# EAGLE design LedMatrix24 (EAGLE 7.7.0)
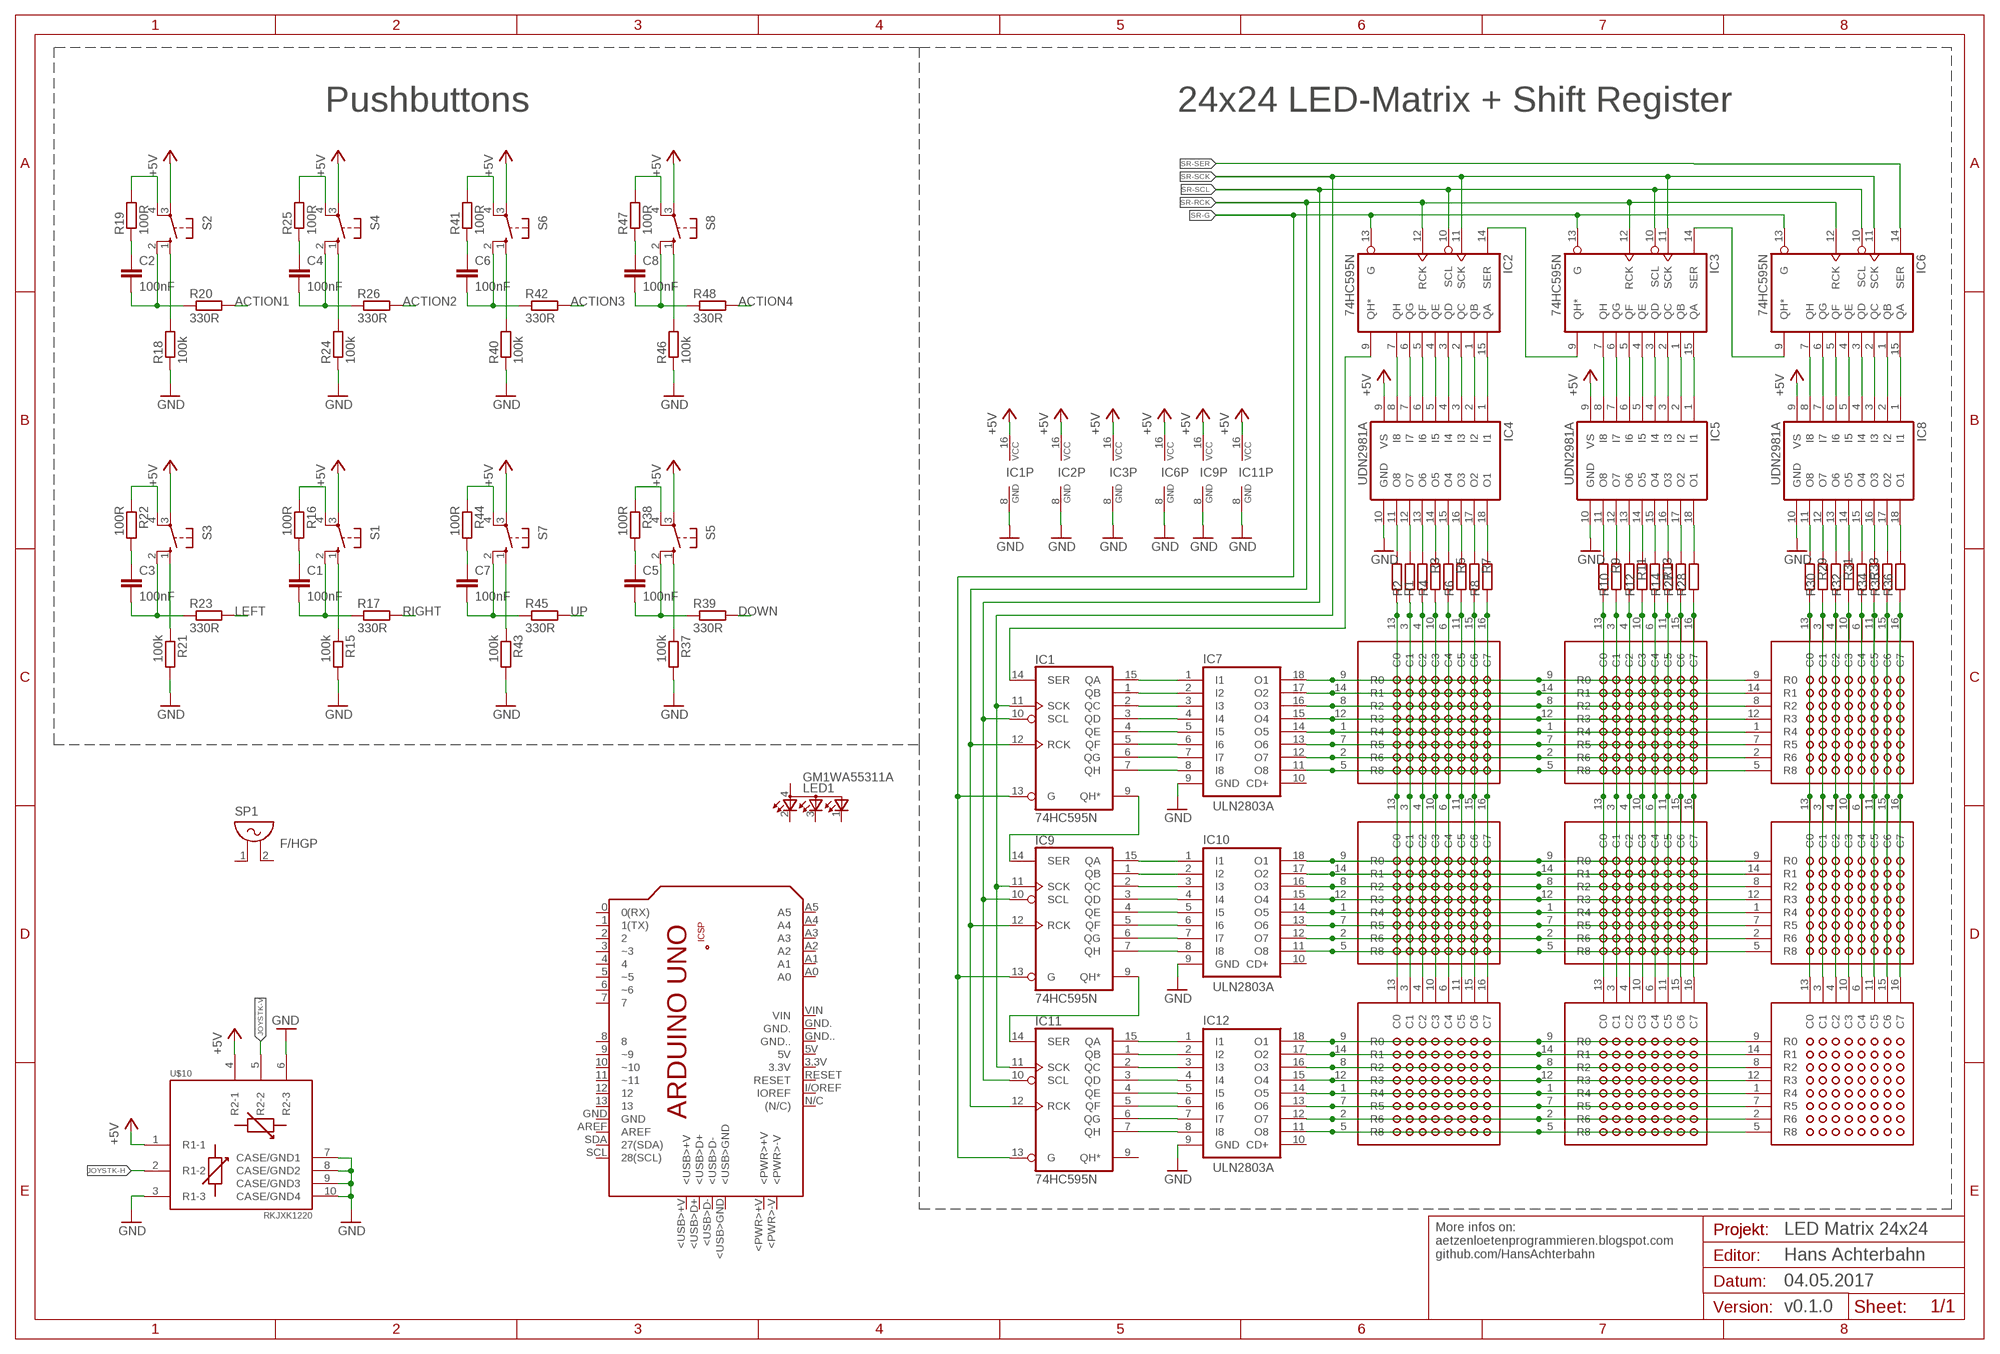
[diagram p0: schematic, sheet 1]

## Parts
C1  100nF  C-EUC0805  [C0805]
C2  100nF  C-EUC0805  [C0805]
C3  100nF  C-EUC0805  [C0805]
C4  100nF  C-EUC0805  [C0805]
C5  100nF  C-EUC0805  [C0805]
C6  100nF  C-EUC0805  [C0805]
C7  100nF  C-EUC0805  [C0805]
C8  100nF  C-EUC0805  [C0805]
IC1  74HC595N  [DIL16]
IC2  74HC595N  [DIL16]
IC3  74HC595N  [DIL16]
IC4  UDN2981A  [DIL18]
IC5  UDN2981A  [DIL18]
IC6  74HC595N  [DIL16]
IC7  ULN2803A  [DIL18]
IC8  UDN2981A  [DIL18]
IC9  74HC595N  [DIL16]
IC10  ULN2803A  [DIL18]
IC11  74HC595N  [DIL16]
IC12  ULN2803A  [DIL18]
LED1  GM1WA55311A  [GM1WA55311A]
PCB1  ARDUINO_UNO  [ARDUINO_UNO]
R1  R-EU_0207/10  [0207/10]
R2  R-EU_0207/10  [0207/10]
R3  R-EU_0207/10  [0207/10]
R4  R-EU_0207/10  [0207/10]
R5  R-EU_0207/10  [0207/10]
R6  R-EU_0207/10  [0207/10]
R7  R-EU_0207/10  [0207/10]
R8  R-EU_0207/10  [0207/10]
R9  R-EU_0207/10  [0207/10]
R10  R-EU_0207/10  [0207/10]
R11  R-EU_0207/10  [0207/10]
R12  R-EU_0207/10  [0207/10]
R13  R-EU_0207/10  [0207/10]
R14  R-EU_0207/10  [0207/10]
R15  100k  R-EU_R0603  [R0603]
R16  100R  R-EU_R0603  [R0603]
R17  330R  R-EU_R0603  [R0603]
R18  100k  R-EU_R0603  [R0603]
R19  100R  R-EU_R0603  [R0603]
R20  330R  R-EU_R0603  [R0603]
R21  100k  R-EU_R0603  [R0603]
R22  100R  R-EU_R0603  [R0603]
R23  330R  R-EU_R0603  [R0603]
R24  100k  R-EU_R0603  [R0603]
R25  100R  R-EU_R0603  [R0603]
R26  330R  R-EU_R0603  [R0603]
R27  R-EU_0207/10  [0207/10]
R28  R-EU_0207/10  [0207/10]
R29  R-EU_0207/10  [0207/10]
R30  R-EU_0207/10  [0207/10]
R31  R-EU_0207/10  [0207/10]
R32  R-EU_0207/10  [0207/10]
R33  R-EU_0207/10  [0207/10]
R34  R-EU_0207/10  [0207/10]
R35  R-EU_0207/10  [0207/10]
R36  R-EU_0207/10  [0207/10]
R37  100k  R-EU_R0603  [R0603]
R38  100R  R-EU_R0603  [R0603]
R39  330R  R-EU_R0603  [R0603]
R40  100k  R-EU_R0603  [R0603]
R41  100R  R-EU_R0603  [R0603]
R42  330R  R-EU_R0603  [R0603]
R43  100k  R-EU_R0603  [R0603]
R44  100R  R-EU_R0603  [R0603]
R45  330R  R-EU_R0603  [R0603]
R46  100k  R-EU_R0603  [R0603]
R47  100R  R-EU_R0603  [R0603]
R48  330R  R-EU_R0603  [R0603]
S1  10-XX  [B3F-10XX]
S2  10-XX  [B3F-10XX]
S3  10-XX  [B3F-10XX]
S4  10-XX  [B3F-10XX]
S5  10-XX  [B3F-10XX]
S6  10-XX  [B3F-10XX]
S7  10-XX  [B3F-10XX]
S8  10-XX  [B3F-10XX]
SP1  F/HGP  [F/HGP]
U$1  TOP-CA-788BS  [TOP-CA-788BS]
U$2  TOP-CA-788BS  [TOP-CA-788BS]
U$3  TOP-CA-788BS  [TOP-CA-788BS]
U$4  TOP-CA-788BS  [TOP-CA-788BS]
U$5  TOP-CA-788BS  [TOP-CA-788BS]
U$6  TOP-CA-788BS  [TOP-CA-788BS]
U$7  TOP-CA-788BS  [TOP-CA-788BS]
U$8  TOP-CA-788BS  [TOP-CA-788BS]
U$9  TOP-CA-788BS  [TOP-CA-788BS]
U$10  RKJXK1220  [RKJXK1220]

## Nets
+5V: IC1.16(VCC) IC2.16(VCC) IC3.16(VCC) IC4.9(VS) IC5.9(VS) IC6.16(VCC) IC8.9(VS) IC9.16(VCC) IC11.16(VCC) S1.3(P) S2.3(P) S3.3(P) S4.3(P) S5.3(P) S6.3(P) S7.3(P) S8.3(P) U$10.1(R1-1) U$10.4(R2-1)
ACTION1: R20.2
ACTION2: R26.2
ACTION3: R42.2
ACTION4: R48.2
DOWN: R39.2
GND: IC1.8(GND) IC2.8(GND) IC3.8(GND) IC4.10(GND) IC5.10(GND) IC6.8(GND) IC7.9(GND) IC8.10(GND) IC9.8(GND) IC10.9(GND) IC11.8(GND) IC12.9(GND) R15.2 R18.1 R21.2 R24.1 R37.2 R40.1 R43.2 R46.1 U$10.3(R1-3) U$10.6(R2-3) U$10.7(CASE/GND1) U$10.8(CASE/GND2) U$10.9(CASE/GND3) U$10.10(CASE/GND4)
JOYSTK-H: U$10.2(R1-2)
JOYSTK-V: U$10.5(R2-2)
LEFT: R23.2
N$1: IC7.16(O3) U$1.8(R2) U$2.8(R2) U$3.8(R2)
N$2: IC7.14(O5) U$1.1(R4) U$2.1(R4) U$3.1(R4)
N$3: IC7.11(O8) U$1.5(R8) U$2.5(R8) U$3.5(R8)
N$4: IC7.15(O4) U$1.12(R3) U$2.12(R3) U$3.12(R3)
N$5: IC5.17(O2) R27.2
N$6: IC5.18(O1) R28.2
N$7: IC3.1(QB) IC5.2(I2)
N$8: IC3.15(QA) IC5.1(I1)
N$9: IC8.11(O8) R29.1
N$10: IC8.12(O7) R30.2
N$11: IC8.13(O6) R31.1
N$12: IC8.14(O5) R32.2
N$13: IC8.15(O4) R33.1
N$14: IC8.16(O3) R34.2
N$15: IC6.2(QC) IC8.3(I3)
N$17: IC6.3(QD) IC8.4(I4)
N$18: IC7.13(O6) U$1.7(R5) U$2.7(R5) U$3.7(R5)
N$19: IC7.12(O7) U$1.2(R6) U$2.2(R6) U$3.2(R6)
N$20: IC6.4(QE) IC8.5(I5)
N$21: IC4.11(O8) R1.2
N$22: IC4.12(O7) R2.2
N$23: IC4.13(O6) R3.1
N$24: IC4.14(O5) R4.2
N$25: IC4.15(O4) R5.1
N$26: IC4.16(O3) R6.2
N$27: IC4.17(O2) R7.1
N$28: IC4.18(O1) R8.2
N$29: IC5.11(O8) R9.1
N$30: IC5.12(O7) R10.2
N$31: IC5.13(O6) R11.1
N$32: IC5.14(O5) R12.2
N$33: IC5.15(O4) R13.1
N$34: IC5.16(O3) R14.2
N$35: IC2.1(QB) IC4.2(I2)
N$36: IC2.2(QC) IC4.3(I3)
N$37: IC2.3(QD) IC4.4(I4)
N$38: IC2.4(QE) IC4.5(I5)
N$39: IC2.5(QF) IC4.6(I6)
N$40: IC2.6(QG) IC4.7(I7)
N$41: IC2.7(QH) IC4.8(I8)
N$42: IC2.15(QA) IC4.1(I1)
N$43: R22.1 S3.4(P1)
N$44: IC3.2(QC) IC5.3(I3)
N$45: IC3.3(QD) IC5.4(I4)
N$46: IC3.4(QE) IC5.5(I5)
N$47: IC3.5(QF) IC5.6(I6)
N$48: IC3.6(QG) IC5.7(I7)
N$49: IC3.7(QH) IC5.8(I8)
N$50: C1.1 R16.2
N$51: IC2.14(SER) IC3.9(QH*)
N$52: IC1.14(SER) IC2.9(QH*)
N$53: R1.1 R2.1 U$1.3(C1) U$1.13(C0) U$4.3(C1) U$4.13(C0) U$7.3(C1) U$7.13(C0)
N$54: R3.2 U$1.4(C2) U$4.4(C2) U$7.4(C2)
N$55: R4.1 U$1.10(C3) U$4.10(C3) U$7.10(C3)
N$56: R5.2 U$1.6(C4) U$4.6(C4) U$7.6(C4)
N$58: R18.2 S2.1(S)
N$59: R19.2 S2.4(P1)
N$60: C1.2 R17.1 S1.2(S1)
N$61: R16.1 S1.4(P1)
N$62: C3.2 R23.1 S3.2(S1)
N$63: C2.2 R20.1 S2.2(S1)
N$64: R21.1 S3.1(S)
N$65: R15.1 S1.1(S)
N$66: C4.1 R25.1
N$67: R25.2 S4.4(P1)
N$68: C2.1 R19.1
N$69: C4.2 R26.1 S4.2(S1)
N$70: C3.1 R22.2
N$71: R24.2 S4.1(S)
N$72: IC6.5(QF) IC8.6(I6)
N$73: IC6.6(QG) IC8.7(I7)
N$74: IC1.2(QC) IC7.3(I3)
N$75: IC1.3(QD) IC7.4(I4)
N$76: IC1.4(QE) IC7.5(I5)
N$77: IC1.5(QF) IC7.6(I6)
N$78: IC1.6(QG) IC7.7(I7)
N$79: IC1.7(QH) IC7.8(I8)
N$80: IC6.7(QH) IC8.8(I8)
N$81: IC3.14(SER) IC6.9(QH*)
N$82: C5.1 R38.2
N$83: C6.1 R41.1
N$84: C7.1 R44.2
N$86: R6.1 U$1.11(C5) U$4.11(C5) U$7.11(C5)
N$87: IC8.17(O2) R35.2
N$88: IC8.18(O1) R36.2
N$89: IC6.1(QB) IC8.2(I2)
N$90: IC6.15(QA) IC8.1(I1)
N$91: R7.2 U$1.15(C6) U$4.15(C6) U$7.15(C6)
N$92: R8.1 U$1.16(C7) U$4.16(C7) U$7.16(C7)
N$93: R9.2 U$2.13(C0) U$5.13(C0) U$8.13(C0)
N$94: R10.1 U$2.3(C1) U$5.3(C1) U$8.3(C1)
N$95: R11.2 U$2.4(C2) U$5.4(C2) U$8.4(C2)
N$96: R12.1 U$2.10(C3) U$5.10(C3) U$8.10(C3)
N$97: R13.2 U$2.6(C4) U$5.6(C4) U$8.6(C4)
N$98: R14.1 U$2.11(C5) U$5.11(C5) U$8.11(C5)
N$99: IC1.9(QH*) IC9.14(SER)
N$100: IC9.9(QH*) IC11.14(SER)
N$101: R29.2 U$3.13(C0) U$6.13(C0) U$9.13(C0)
N$102: R30.1 U$3.3(C1) U$6.3(C1) U$9.3(C1)
N$103: R31.2 U$3.4(C2) U$6.4(C2) U$9.4(C2)
N$104: R32.1 U$3.10(C3) U$6.10(C3) U$9.10(C3)
N$105: R33.2 U$3.6(C4) U$6.6(C4) U$9.6(C4)
N$106: R34.1 U$3.11(C5) U$6.11(C5) U$9.11(C5)
N$107: R35.1 U$3.15(C6) U$6.15(C6) U$9.15(C6)
N$108: R36.1 U$3.16(C7) U$6.16(C7) U$9.16(C7)
N$109: R28.1 U$2.16(C7) U$5.16(C7) U$8.16(C7)
N$110: R27.1 U$2.15(C6) U$5.15(C6) U$8.15(C6)
N$111: IC7.17(O2) U$1.14(R1) U$2.14(R1) U$3.14(R1)
N$112: IC7.18(O1) U$1.9(R0) U$2.9(R0) U$3.9(R0)
N$113: IC10.13(O6) U$4.7(R5) U$5.7(R5) U$6.7(R5)
N$114: IC10.12(O7) U$4.2(R6) U$5.2(R6) U$6.2(R6)
N$115: IC1.15(QA) IC7.1(I1)
N$116: IC9.2(QC) IC10.3(I3)
N$117: IC9.3(QD) IC10.4(I4)
N$118: IC9.4(QE) IC10.5(I5)
N$119: IC9.5(QF) IC10.6(I6)
N$120: IC9.6(QG) IC10.7(I7)
N$121: IC9.7(QH) IC10.8(I8)
N$122: IC10.16(O3) U$4.8(R2) U$5.8(R2) U$6.8(R2)
N$123: IC10.14(O5) U$4.1(R4) U$5.1(R4) U$6.1(R4)
N$124: IC10.11(O8) U$4.5(R8) U$5.5(R8) U$6.5(R8)
N$125: IC10.15(O4) U$4.12(R3) U$5.12(R3) U$6.12(R3)
N$126: R44.1 S7.4(P1)
N$127: R41.2 S6.4(P1)
N$129: R38.1 S5.4(P1)
N$130: IC10.17(O2) U$4.14(R1) U$5.14(R1) U$6.14(R1)
N$131: IC10.18(O1) U$4.9(R0) U$5.9(R0) U$6.9(R0)
N$132: IC12.13(O6) U$7.7(R5) U$8.7(R5) U$9.7(R5)
N$133: IC12.12(O7) U$7.2(R6) U$8.2(R6) U$9.2(R6)
N$134: IC1.1(QB) IC7.2(I2)
N$135: IC11.2(QC) IC12.3(I3)
N$136: IC11.3(QD) IC12.4(I4)
N$137: IC11.4(QE) IC12.5(I5)
N$138: IC11.5(QF) IC12.6(I6)
N$139: IC11.6(QG) IC12.7(I7)
N$140: IC11.7(QH) IC12.8(I8)
N$141: IC12.16(O3) U$7.8(R2) U$8.8(R2) U$9.8(R2)
N$142: IC12.14(O5) U$7.1(R4) U$8.1(R4) U$9.1(R4)
N$143: IC12.11(O8) U$7.5(R8) U$8.5(R8) U$9.5(R8)
N$144: IC12.15(O4) U$7.12(R3) U$8.12(R3) U$9.12(R3)
N$147: C5.2 R39.1 S5.2(S1)
N$148: C7.2 R45.1 S7.2(S1)
N$149: IC12.17(O2) U$7.14(R1) U$8.14(R1) U$9.14(R1)
N$150: IC12.18(O1) U$7.9(R0) U$8.9(R0) U$9.9(R0)
N$151: IC9.15(QA) IC10.1(I1)
N$152: IC9.1(QB) IC10.2(I2)
N$153: IC11.15(QA) IC12.1(I1)
N$154: IC11.1(QB) IC12.2(I2)
N$155: C6.2 R42.1 S6.2(S1)
N$156: R40.2 S6.1(S)
N$157: R43.1 S7.1(S)
N$158: R37.1 S5.1(S)
N$159: C8.1 R47.1
N$160: R47.2 S8.4(P1)
N$161: C8.2 R48.1 S8.2(S1)
N$162: R46.2 S8.1(S)
RIGHT: R17.2
SR-G: IC1.13(G) IC2.13(G) IC3.13(G) IC6.13(G) IC9.13(G) IC11.13(G)
SR-RCK: IC1.12(RCK) IC2.12(RCK) IC3.12(RCK) IC6.12(RCK) IC9.12(RCK) IC11.12(RCK)
SR-SCK: IC1.11(SCK) IC2.11(SCK) IC3.11(SCK) IC6.11(SCK) IC9.11(SCK) IC11.11(SCK)
SR-SCL: IC1.10(SCL) IC2.10(SCL) IC3.10(SCL) IC6.10(SCL) IC9.10(SCL) IC11.10(SCL)
SR-SER: IC6.14(SER)
UP: R45.2
Unconnected: IC7.10(CD+) IC10.10(CD+) IC11.9(QH*) IC12.10(CD+) LED1.1(CGREEN) LED1.2(CRED) LED1.3(CBLUE) LED1.4(A) PCB1.0(0(RX)) PCB1.1(1(TX)) PCB1.2 PCB1.3(~3) PCB1.3.3V PCB1.4 PCB1.5(~5) PCB1.5V PCB1.6(~6) PCB1.7 PCB1.8 PCB1.9(~9) PCB1.10(~10) PCB1.11(~11) PCB1.12 PCB1.13 PCB1.+5V PCB1.<PWR>+V PCB1.<PWR>-V PCB1.<USB>+V PCB1.<USB>D+ PCB1.<USB>D- PCB1.<USB>GND PCB1.A0 PCB1.A1 PCB1.A2 PCB1.A3 PCB1.A4 PCB1.A5 PCB1.AREF PCB1.GND PCB1.GND. PCB1.GND.. PCB1.GND_ PCB1.I/OREF(IOREF) PCB1.MISO PCB1.MOSI PCB1.N/C((N/C)) PCB1.RESET PCB1.RESET. PCB1.SCK PCB1.SCL(28(SCL)) PCB1.SDA(27(SDA)) PCB1.VIN SP1.1 SP1.2

## Notes on the sheet
- Pushbuttons | 24x24 LED-Matrix + Shift Register
- ULN2803A
- ULN2803A
- ULN2803A
- More infos on:
  aetzenloetenprogrammieren.blogspot.com
  github.com/HansAchterbahn
- LED Matrix 24x24
- Hans Achterbahn
- 04.05.2017
- v0.1.0

## Library data of the parts
C1-C8 = rcl:C-EU: CAPACITOR, European symbol
IC1-IC3 IC6 IC9 IC11 = 74xx-eu:74*595: 8-bit SHIFT REGISTER, output latch
IC4 IC5 IC8 = uln-udn:UDN298*: DRIVER ARRAY Source: Allegro Microsystems Inc. / UDN2981-UDN2984.pdf
IC7 IC10 IC12 = uln-udn:ULN2803A: DRIVER ARRAY
LED1 = led:GM1WA55311A: Chip LED RGB Source: http://document.sharpsma.com/files/GM1WA55311A_SS.pdf
PCB1 = E14_Arduino_revC:ARDUINO_UNO: Device for representing an Arduino Uno board with a footprint in an EAGLE design. Created by Dave Young for Element14. More EAGLE documentation at: http://www.element14.com/community/community/knode/cadsoft_eagle
R1-R48 = rcl:R-EU_: RESISTOR, European symbol
S1-S8 = switch-omron:10-XX: OMRON SWITCH
SP1 = buzzer:F/HGP: BUZZER Source: Buerklin; OC_FARNELL: unknown; OC_NEWARK: unknown
U$1-U$9 = h8-optic:TOP-CA-788BS
U$10 = h8-switch:RKJXK1220

## Board
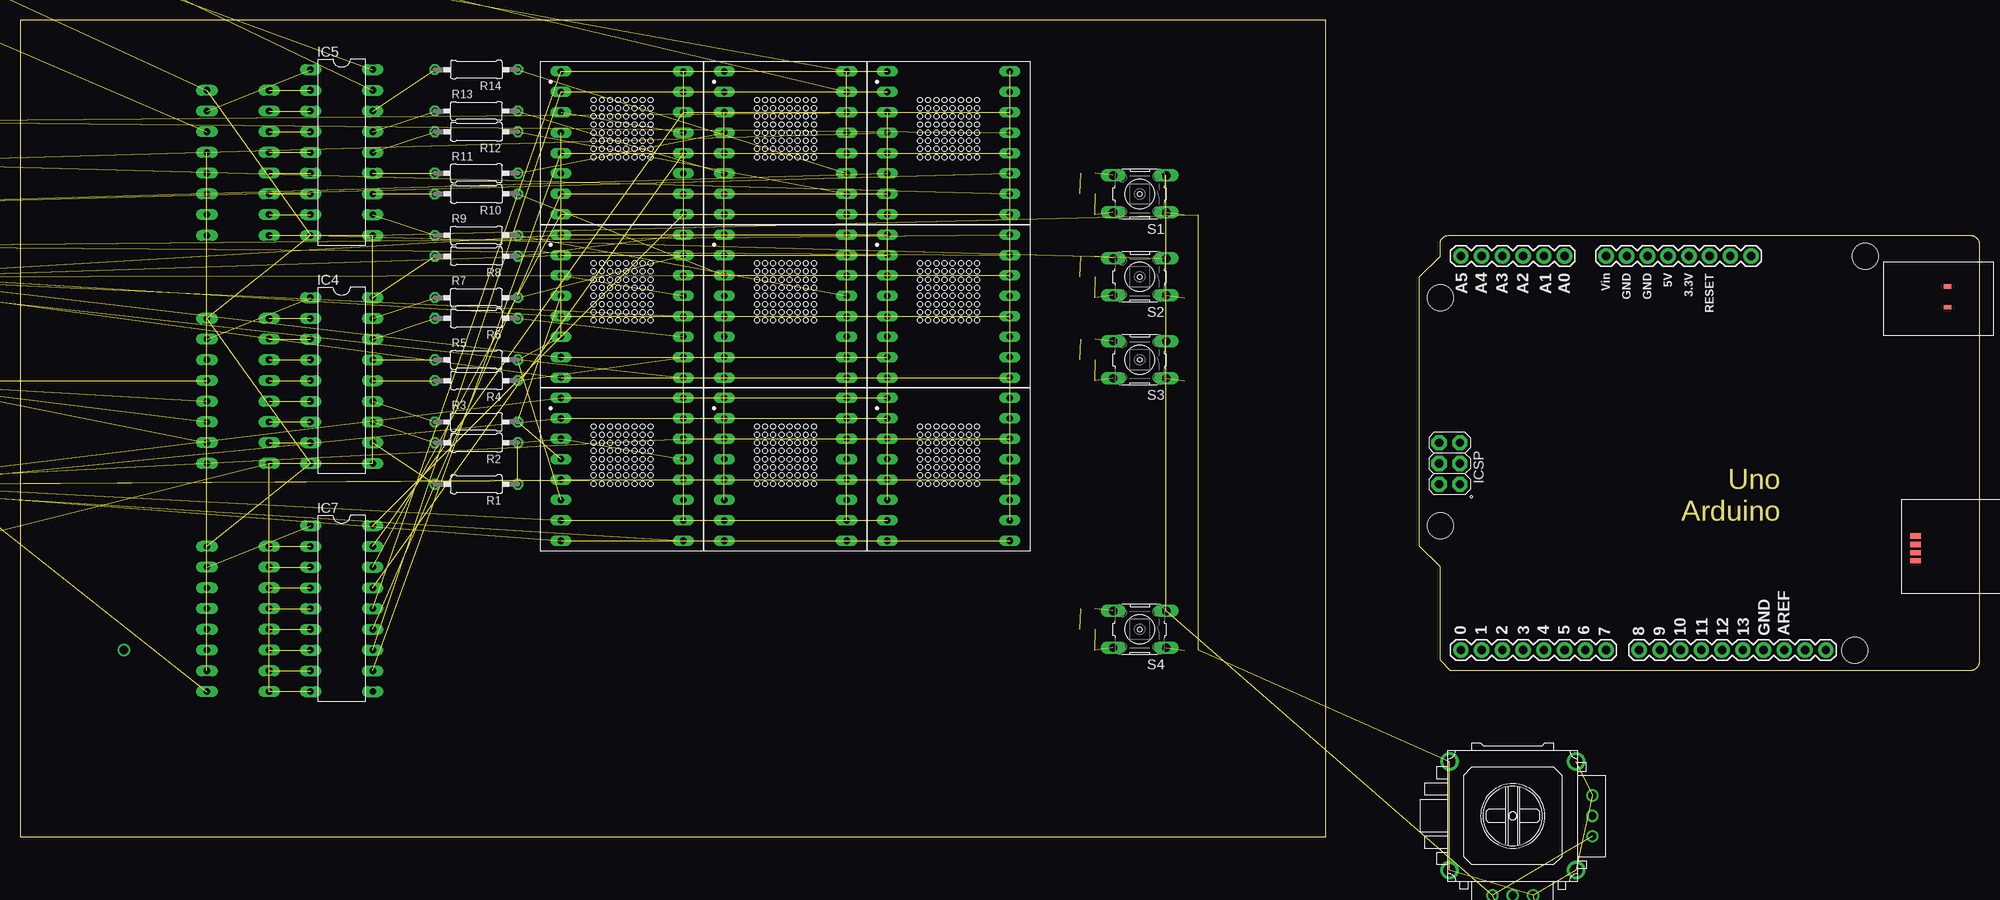
[diagram p1: board, top side]
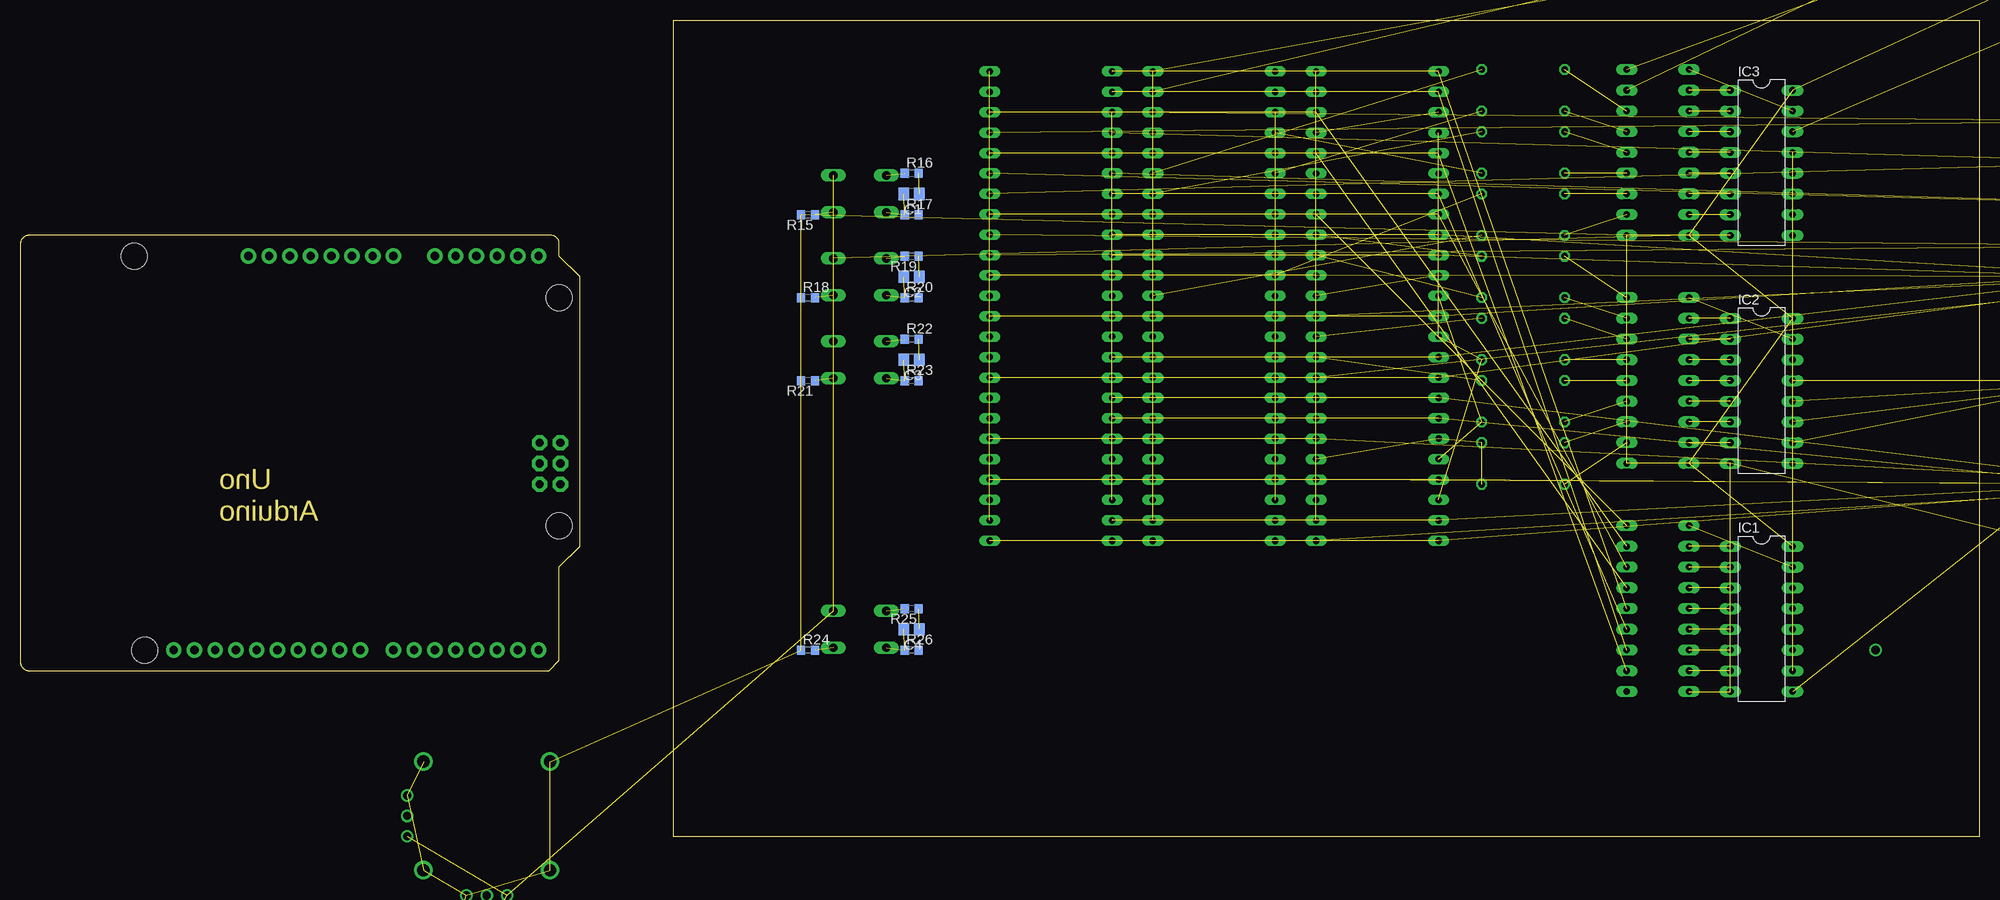
[diagram p2: board, bottom side, seen from below]

Size 160 x 100 mm. Coordinates in mm from the lower left corner, seen from the top.
Outline: 0,0 160,0 160,100 0,100 0,0
Copper layers (1*16): Top 0.035mm / dielectric 1.5mm / Bottom 0.035mm
Design rules "default": minimum track width 10mil, minimum drill 24mil, track to track 8mil, track to pad 8mil, pad to pad 8mil, via to via 8mil, smd to smd 8mil, copper to edge 40mil, drill to drill 8mil, minimum pad ring 10mil, minimum via ring 8mil, stop-mask expansion 4mil, vias tented up to drill 0mil, thermal gap 10mil

### Footprints (pad centres in the part's own frame; a part is rotated, then mirrored left to right if it is on the bottom)
C0805 = smd 1.3 x 1.5: 1 -0.95,0; 2 0.95,0
DIL16 = drill 0.813 long: 1 -8.89,-3.81; 2 -6.35,-3.81; 3 -3.81,-3.81; 4 -1.27,-3.81; 5 1.27,-3.81; 6 3.81,-3.81; 7 6.35,-3.81; 8 8.89,-3.81; 9 8.89,3.81; 10 6.35,3.81; 11 3.81,3.81; 12 1.27,3.81; 13 -1.27,3.81; 14 -3.81,3.81; 15 -6.35,3.81; 16 -8.89,3.81
DIL18 = drill 0.813 long: 1 -10.16,-3.81; 2 -7.62,-3.81; 3 -5.08,-3.81; 4 -2.54,-3.81; 5 0,-3.81; 6 2.54,-3.81; 7 5.08,-3.81; 8 7.62,-3.81; 9 10.16,-3.81; 10 10.16,3.81; 11 7.62,3.81; 12 5.08,3.81; 13 2.54,3.81; 14 0,3.81; 15 -2.54,3.81; 16 -5.08,3.81; 17 -7.62,3.81; 18 -10.16,3.81
GM1WA55311A = smd 0.65 x 1.2: 1 -0.475,0.9; 2 -0.475,-0.9; 3 0.475,-0.9; 4 0.475,0.9
ARDUINO_UNO = drill 1.016 pad 1.88: 0 63.5,50.8; 1 60.96,50.8; 2 58.42,50.8; 3 55.88,50.8; 3.3V 35.56,2.54; 4 53.34,50.8; 5 50.8,50.8; 5V 38.1,2.54; 6 48.26,50.8; 7 45.72,50.8; 8 41.656,50.8; 9 39.116,50.8; 10 36.576,50.8; 11 34.036,50.8; 12 31.496,50.8; 13 28.956,50.8; A0 50.8,2.54; A1 53.34,2.54; A2 55.88,2.54; A3 58.42,2.54; A4 60.96,2.54; A5 63.5,2.54; AREF 23.876,50.8; GND 26.416,50.8; GND. 43.18,2.54; GND.. 40.64,2.54; I/OREF 30.48,2.54; N/C 27.94,2.54; RESET 33.02,2.54; SCL 18.796,50.8; SDA 21.336,50.8; VIN 45.72,2.54 | drill 1.016 pad 1.88 octagon: +5V 66.167,30.48; GND_ 66.167,25.4; MISO 63.627,30.48; MOSI 66.167,27.94; RESET. 63.627,25.4; SCK 63.627,27.94 | smd 1.016 x 0.508: <PWR>+V 3.861,8.814; <PWR>-V 3.861,6.274 | smd 1.27 x 0.635: <USB>+V 7.772,39.878; <USB>D+ 7.772,38.887; <USB>D- 7.772,37.871; <USB>GND 7.772,36.83 | hole 3.2: 66.04,7.62; 66.04,35.56; 15.24,50.8; 13.97,2.54
0207/10 = drill 0.813 octagon: 1 -5.08,0; 2 5.08,0
R0603 = smd 1 x 1.1: 1 -0.85,0; 2 0.85,0
B3F-10XX = drill 1.016 long: 1 -3.251,2.261; 2 3.251,2.261; 3 -3.251,-2.261; 4 3.251,-2.261
F/HGP = drill 1.016 pad 2.159 octagon: 1 -3.81,0; 2 3.81,0
TOP-CA-788BS = drill 0.8 long: 1 0,0; 2 0,-2.5; 3 0,-5; 4 0,-7.5; 5 0,-10; 6 0,-12.5; 7 0,-15; 8 0,-17.5; 9 15,-17.5; 10 15,-15; 11 15,-12.5; 12 15,-10; 13 15,-7.5; 14 15,-5; 15 15,-2.5; 16 15,0
RKJXK1220 = drill 1: 1 -2.5,-9.75; 2 0,-9.75; 3 2.5,-9.75; 4 9.75,-2.5; 5 9.75,0; 6 9.75,2.5 | drill 1.5: 7 -7.75,-6.65; 8 7.75,-6.65; 9 7.75,6.65; 10 -7.75,6.65

### Placement (x,y rotation side)
C1  130.81,78.74 180 bottom
C2  130.81,68.58 180 bottom
C3  130.81,58.42 180 bottom
C4  130.81,25.4 180 bottom
C5  196.85,-21.59 0 top  (outside the outline)
C6  173.99,-30.48 0 top  (outside the outline)
C7  180.34,-30.48 0 top  (outside the outline)
C8  186.69,-30.48 0 top  (outside the outline)
IC1  26.67,26.67 270 bottom
IC2  26.67,54.61 270 bottom
IC3  26.67,82.55 270 bottom
IC4  39.37,55.88 270 top
IC5  39.37,83.82 270 top
IC6  -21.59,97.79 0 top  (outside the outline)
IC7  39.37,27.94 270 top
IC8  -20.32,110.49 0 top  (outside the outline)
IC9  -21.59,52.07 0 top  (outside the outline)
IC10  -20.32,64.77 0 top  (outside the outline)
IC11  -21.59,26.67 0 top  (outside the outline)
IC12  -20.32,39.37 0 top  (outside the outline)
LED1  -38.1,-53.34 0 top  (outside the outline)
PCB1  240.03,73.66 180 top  (outside the outline)
R1  55.88,43.18 180 top
R2  55.88,48.26 180 top
R3  55.88,50.8 0 top
R4  55.88,55.88 180 top
R5  55.88,58.42 0 top
R6  55.88,63.5 180 top
R7  55.88,66.04 0 top
R8  55.88,71.12 180 top
R9  55.88,73.66 0 top
R10  55.88,78.74 180 top
R11  55.88,81.28 0 top
R12  55.88,86.36 180 top
R13  55.88,88.9 0 top
R14  55.88,93.98 180 top
R15  143.51,76.2 180 bottom
R16  130.81,81.28 0 bottom
R17  130.81,76.2 0 bottom
R18  143.51,66.04 0 bottom
R19  130.81,71.12 180 bottom
R20  130.81,66.04 0 bottom
R21  143.51,55.88 180 bottom
R22  130.81,60.96 0 bottom
R23  130.81,55.88 0 bottom
R24  143.51,22.86 0 bottom
R25  130.81,27.94 180 bottom
R26  130.81,22.86 0 bottom
R27  -27.94,123.19 0 top  (outside the outline)
R28  -27.94,118.11 0 top  (outside the outline)
R29  -27.94,87.63 0 top  (outside the outline)
R30  -15.24,87.63 0 top  (outside the outline)
R31  -27.94,82.55 0 top  (outside the outline)
R32  -15.24,82.55 0 top  (outside the outline)
R33  -27.94,77.47 0 top  (outside the outline)
R34  -15.24,77.47 0 top  (outside the outline)
R35  -27.94,72.39 0 top  (outside the outline)
R36  -15.24,72.39 0 top  (outside the outline)
R37  193.04,-41.91 0 top  (outside the outline)
R38  193.04,-30.48 0 top  (outside the outline)
R39  173.99,-36.83 0 top  (outside the outline)
R40  199.39,-41.91 0 top  (outside the outline)
R41  180.34,-36.83 0 top  (outside the outline)
R42  186.69,-36.83 0 top  (outside the outline)
R43  173.99,-46.99 0 top  (outside the outline)
R44  193.04,-36.83 0 top  (outside the outline)
R45  173.99,-41.91 0 top  (outside the outline)
R46  180.34,-46.99 0 top  (outside the outline)
R47  180.34,-41.91 0 top  (outside the outline)
R48  186.69,-41.91 0 top  (outside the outline)
S1  137.16,78.74 180 top
S2  137.16,68.58 180 top
S3  137.16,58.42 180 top
S4  137.16,25.4 180 top
S5  177.8,-15.24 0 top  (outside the outline)
S6  189.23,-15.24 0 top  (outside the outline)
S7  177.8,-24.13 0 top  (outside the outline)
S8  189.23,-24.13 0 top  (outside the outline)
SP1  -19.05,10.16 0 top  (outside the outline)
U$1  66.25,93.75 0 top
U$2  86.25,93.75 0 top
U$3  106.25,93.75 0 top
U$4  66.25,73.75 0 top
U$5  86.25,73.75 0 top
U$6  106.25,73.75 0 top
U$7  66.25,53.75 0 top
U$8  86.25,53.75 0 top
U$9  106.25,53.75 0 top
U$10  182.88,2.54 0 top  (outside the outline)

### Tracks (layer width: path | path; a pad name or v marks a point on that pad's centre or on a via)
+5V  (18 unrouted)
GND  (25 unrouted)
N$1  (3 unrouted)
N$2  (3 unrouted)
N$3  (3 unrouted)
N$4  (3 unrouted)
N$5  (1 unrouted)
N$6  (1 unrouted)
N$7  (1 unrouted)
N$8  (1 unrouted)
N$9  (1 unrouted)
N$10  (1 unrouted)
N$11  (1 unrouted)
N$12  (1 unrouted)
N$13  (1 unrouted)
N$14  (1 unrouted)
N$15  (1 unrouted)
N$16  (via drill 1)
  other vias: 12.7,22.86
N$17  (1 unrouted)
N$18  (3 unrouted)
N$19  (3 unrouted)
N$20  (1 unrouted)
N$21  (1 unrouted)
N$22  (1 unrouted)
N$23  (1 unrouted)
N$24  (1 unrouted)
N$25  (1 unrouted)
N$26  (1 unrouted)
N$27  (1 unrouted)
N$28  (1 unrouted)
N$29  (1 unrouted)
N$30  (1 unrouted)
N$31  (1 unrouted)
N$32  (1 unrouted)
N$33  (1 unrouted)
N$34  (1 unrouted)
N$35  (1 unrouted)
N$36  (1 unrouted)
N$37  (1 unrouted)
N$38  (1 unrouted)
N$39  (1 unrouted)
N$40  (1 unrouted)
N$41  (1 unrouted)
N$42  (1 unrouted)
N$43  (1 unrouted)
N$44  (1 unrouted)
N$45  (1 unrouted)
N$46  (1 unrouted)
N$47  (1 unrouted)
N$48  (1 unrouted)
N$49  (1 unrouted)
N$50  (1 unrouted)
N$51  (1 unrouted)
N$52  (1 unrouted)
N$53  (7 unrouted)
N$54  (3 unrouted)
N$55  (3 unrouted)
N$56  (3 unrouted)
N$58  (1 unrouted)
N$59  (1 unrouted)
N$60  (2 unrouted)
N$61  (1 unrouted)
N$62  (2 unrouted)
N$63  (2 unrouted)
N$64  (1 unrouted)
N$65  (1 unrouted)
N$66  (1 unrouted)
N$67  (1 unrouted)
N$68  (1 unrouted)
N$69  (2 unrouted)
N$70  (1 unrouted)
N$71  (1 unrouted)
N$72  (1 unrouted)
N$73  (1 unrouted)
N$74  (1 unrouted)
N$75  (1 unrouted)
N$76  (1 unrouted)
N$77  (1 unrouted)
N$78  (1 unrouted)
N$79  (1 unrouted)
N$80  (1 unrouted)
N$81  (1 unrouted)
N$82  (1 unrouted)
N$83  (1 unrouted)
N$84  (1 unrouted)
N$86  (3 unrouted)
N$87  (1 unrouted)
N$88  (1 unrouted)
N$89  (1 unrouted)
N$90  (1 unrouted)
N$91  (3 unrouted)
N$92  (3 unrouted)
N$93  (3 unrouted)
N$94  (3 unrouted)
N$95  (3 unrouted)
N$96  (3 unrouted)
N$97  (3 unrouted)
N$98  (3 unrouted)
N$99  (1 unrouted)
N$100  (1 unrouted)
N$101  (3 unrouted)
N$102  (3 unrouted)
N$103  (3 unrouted)
N$104  (3 unrouted)
N$105  (3 unrouted)
N$106  (3 unrouted)
N$107  (3 unrouted)
N$108  (3 unrouted)
N$109  (3 unrouted)
N$110  (3 unrouted)
N$111  (3 unrouted)
N$112  (3 unrouted)
N$113  (3 unrouted)
N$114  (3 unrouted)
N$115  (1 unrouted)
N$116  (1 unrouted)
N$117  (1 unrouted)
N$118  (1 unrouted)
N$119  (1 unrouted)
N$120  (1 unrouted)
N$121  (1 unrouted)
N$122  (3 unrouted)
N$123  (3 unrouted)
N$124  (3 unrouted)
N$125  (3 unrouted)
N$126  (1 unrouted)
N$127  (1 unrouted)
N$129  (1 unrouted)
N$130  (3 unrouted)
N$131  (3 unrouted)
N$132  (3 unrouted)
N$133  (3 unrouted)
N$134  (1 unrouted)
N$135  (1 unrouted)
N$136  (1 unrouted)
N$137  (1 unrouted)
N$138  (1 unrouted)
N$139  (1 unrouted)
N$140  (1 unrouted)
N$141  (3 unrouted)
N$142  (3 unrouted)
N$143  (3 unrouted)
N$144  (3 unrouted)
N$147  (2 unrouted)
N$148  (2 unrouted)
N$149  (3 unrouted)
N$150  (3 unrouted)
N$151  (1 unrouted)
N$152  (1 unrouted)
N$153  (1 unrouted)
N$154  (1 unrouted)
N$155  (2 unrouted)
N$156  (1 unrouted)
N$157  (1 unrouted)
N$158  (1 unrouted)
N$159  (1 unrouted)
N$160  (1 unrouted)
N$161  (2 unrouted)
N$162  (1 unrouted)
SR-G  (5 unrouted)
SR-RCK  (5 unrouted)
SR-SCK  (5 unrouted)
SR-SCL  (5 unrouted)